# Altium schematic sheet Analog Sense.SchDoc
size A2; VersionControl_RevNumber: DNP; IsUserConfigurable: DNP; Page Size: A2; RevCode: A; PageSize: A2; TopSchematic: True; Address4: United States
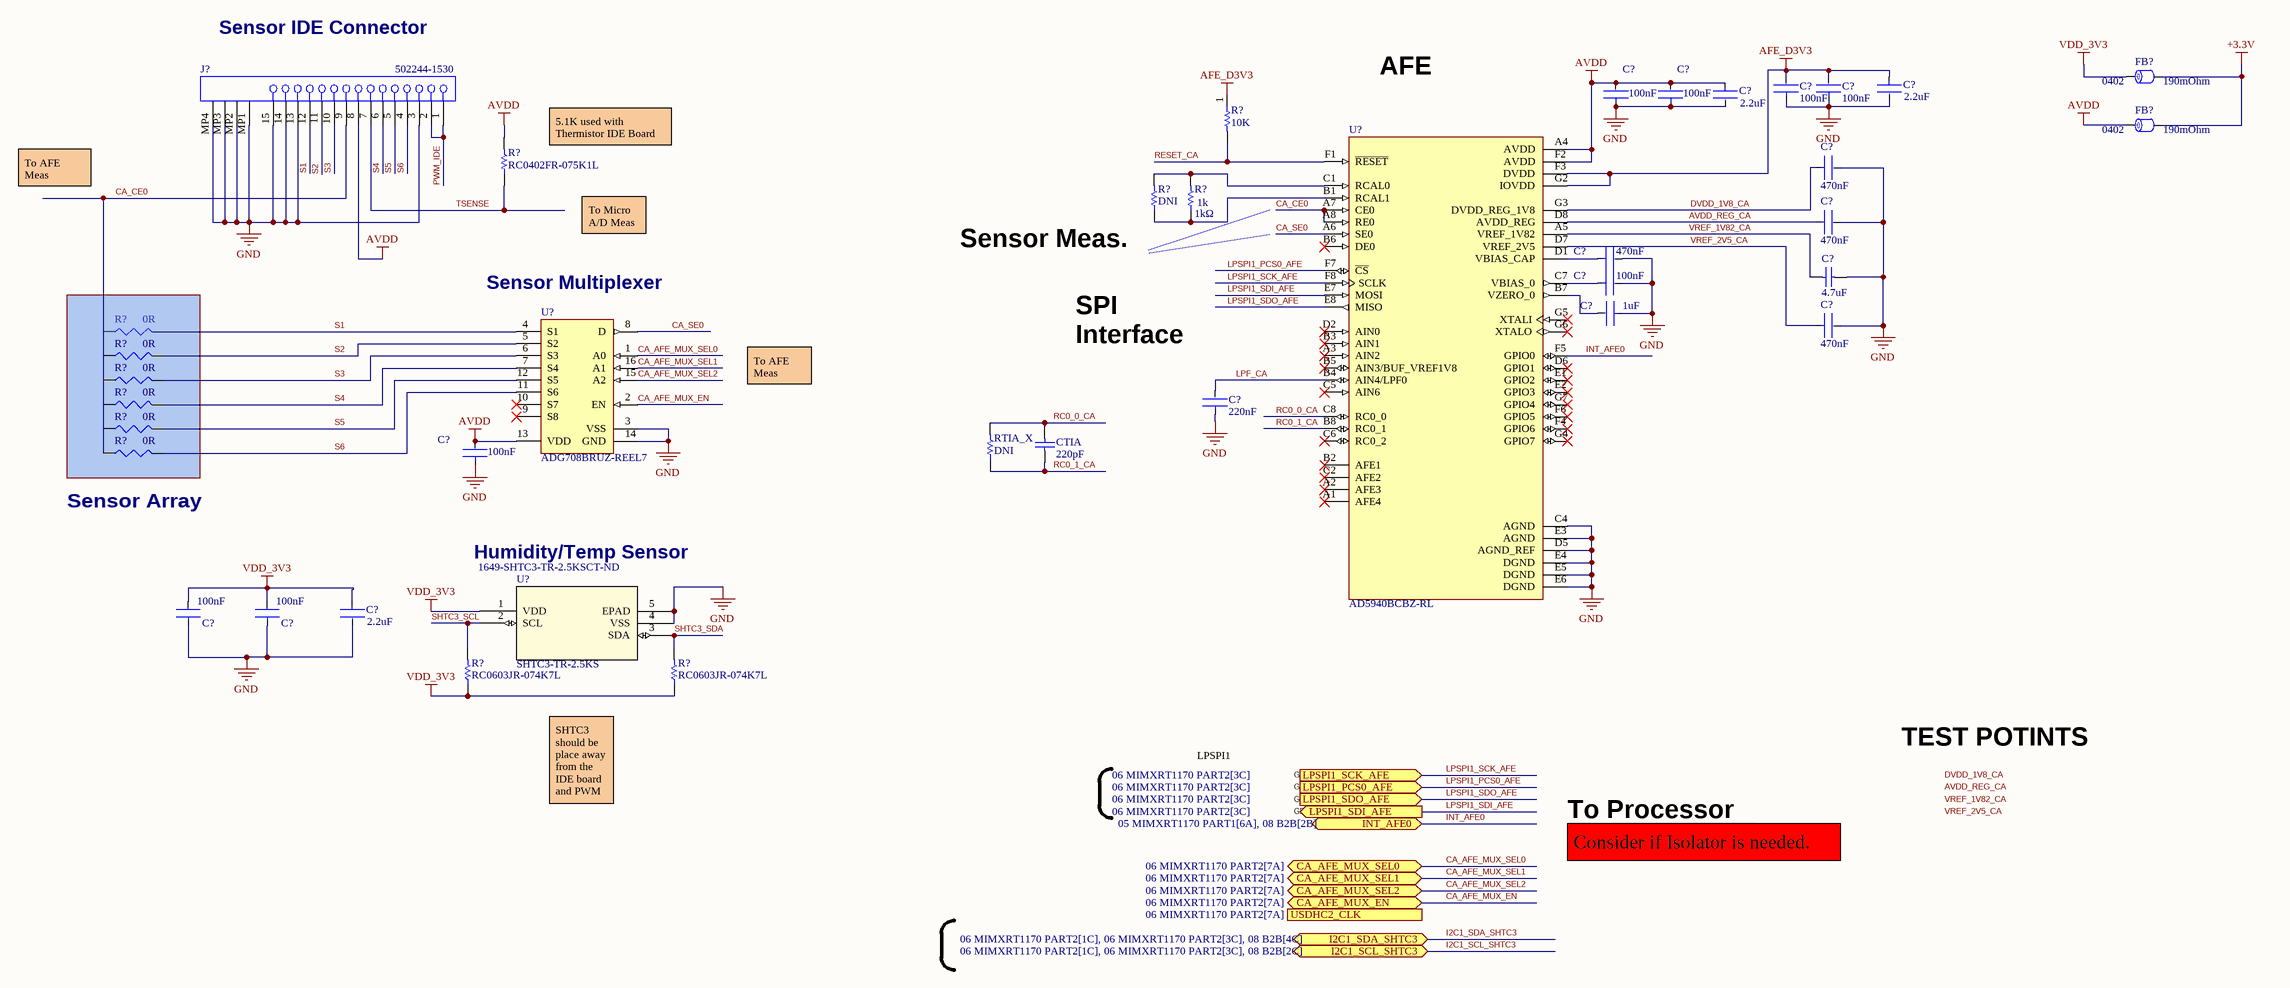
[diagram p0: Analog Sense.SchDoc]

## Parts
(Parts that share a designator on the sheet are numbered #1, #2 ... from top to bottom, then left to right.)
C?#1  Capacitance: 2.2uF  [FP-GRM155-0_2-IPC_B]  (hidden comment: GRM155R61C225KE11D)
C?#2  Capacitance: 2.2uF  [FP-GRM155-0_2-IPC_B]  (hidden comment: GRM155R61C225KE11D)
C?#3  value 100nF  [FP-C0603-CJ-MFG]  (hidden comment: C0603X104K5RACTU)
C?#4  value 100nF  [FP-C0603-CJ-MFG]  (hidden comment: C0603X104K5RACTU)
C?#5  value 100nF  [FP-C0603-CJ-MFG]  (hidden comment: C0603X104K5RACTU)
C?#6  value 100nF  [FP-C0603-CJ-MFG]  (hidden comment: C0603X104K5RACTU)
C?#7  Capacitance: 470nF  [FP-GRM188-0_1-e0_2_0_5-IPC_B]  (hidden comment: GRM188R71C474KA88D)
C?#8  Capacitance: 470nF  [FP-GRM188-0_1-e0_2_0_5-IPC_B]  (hidden comment: GRM188R71C474KA88D)
C?#9  Capacitance: 470nF  [FP-GRM188-0_1-e0_2_0_5-IPC_B]  (hidden comment: GRM188R71C474KA88D)
C?#10  4.7uF  [0603_CAP_NP]
C?#11  Capacitance: 100nF  [FP-C0603-CJ-MFG]  (hidden comment: C0603X104K5RACTU)
C?#12  Capacitance: 1uF  [FP-C1608-080-0_1-IPC_B]  (hidden comment: C1608X5R1H105K080AB)
C?#13  Capacitance: 470nF  [FP-GRM188-0_1-e0_2_0_5-IPC_B]  (hidden comment: GRM188R71C474KA88D)
C?#14  Capacitance: 220nF  [FP-GRM155-0_05-IPC_A]  (hidden comment: GRM155R61A224KE19D)
C?#15  value 100nF  [FP-C0603-CJ-MFG]  (hidden comment: C0603X104K5RACTU)
C?#16  Capacitance: 2.2uF  [FP-GRM155-0_2-IPC_B]  (hidden comment: GRM155R61C225KE11D)
C?#17  value 100nF  [FP-C0603-CJ-MFG]  (hidden comment: C0603X104K5RACTU)
C?#18  value 100nF  [FP-C0603-CJ-MFG]  (hidden comment: C0603X104K5RACTU)
CTIA  220pF  [CAPC1005X56X25LL10T15]
FB?#1  Package: 0402  Rdc max: 190mOhm  [L0402_H0.55MM]  (hidden comment: __Template_Ferrite_Bead)
FB?#2  Package: 0402  Rdc max: 190mOhm  [L0402_H0.55MM]  (hidden comment: __Template_Ferrite_Bead)
J?  502244-1530  [MOLX-502244-1530]
R?#1  Resistance: 10K  [RESC1005X40X25ML05T10]  (hidden comment: CRCW040210K0FKEDHP)
R?#2  RC0402FR-075K1L  [RESC1005X40X25NL05T10]
R?#3  value DNI  [0402_RES]  (hidden comment: 0Ω)
R?#4  1k  value 1kΩ  [0402_RES]
R?#5  0R  [R0805]  (graphical)
R?#6  0R  [R0805]  (graphical)
R?#7  0R  [R0805]  (graphical)
R?#8  0R  [R0805]  (graphical)
R?#9  0R  [R0805]  (graphical)
R?#10  0R  [R0805]  (graphical)
R?#11  RC0603JR-074K7L  [RESC1608X55X25ML10T15]
R?#12  RC0603JR-074K7L  [RESC1608X55X25ML10T15]
RTIA_X  value DNI  [0402_RES]  (hidden comment: 0Ω)
U?#1  ADG708BRUZ-REEL7  [ADI-RU-16_N]
U?#2  AD5940BCBZ-RL  [BGA56N40P7X8_356X416X55N]
U?#3  SHTC3-TR-2.5KS  Supplier Part Number 1: 1649-SHTC3-TR-2.5KSCT-ND  [SHTC3_SEN]

## Ports
CA_AFE_MUX_EN (bidir, see 06 MIMXRT1170 PART2[7A]), CA_AFE_MUX_SEL0 (bidir, see 06 MIMXRT1170 PART2[7A]), CA_AFE_MUX_SEL1 (bidir, see 06 MIMXRT1170 PART2[7A]), CA_AFE_MUX_SEL2 (bidir, see 06 MIMXRT1170 PART2[7A]), I2C1_SCL_SHTC3 (bidir, see 06 MIMXRT1170 PART2[1C], 06 MIMXRT1170 PART2[3C], 08 B2B[2C]), I2C1_SDA_SHTC3 (bidir, see 06 MIMXRT1170 PART2[1C], 06 MIMXRT1170 PART2[3C], 08 B2B[4C]), INT_AFE0 (bidir, see 05 MIMXRT1170 PART1[6A], 08 B2B[2B]), LPSPI1_PCS0_AFE (in, see 06 MIMXRT1170 PART2[3C]), LPSPI1_SCK_AFE (in, see 06 MIMXRT1170 PART2[3C]), LPSPI1_SDI_AFE (out, see 06 MIMXRT1170 PART2[3C]), LPSPI1_SDO_AFE (in, see 06 MIMXRT1170 PART2[3C]), USDHC2_CLK (in, see 06 MIMXRT1170 PART2[7A])

## Nets
+3.3V: FB?#1.2 FB?#2.2
AFE_D3V3: C?#1.1 C?#3.2 C?#4.2 R?#1.1 U?#2.F3(DVDD) U?#2.G2(IOVDD)
AVDD: C?#2.1 C?#5.2 C?#6.2 C?#15.2 FB?#2.1 J?.8 R?#2.2 U?#1.13(VDD) U?#2.A4(AVDD) U?#2.F2(AVDD)
GND: C?#1.2 C?#2.2 C?#3.1 C?#4.1 C?#5.1 C?#6.1 C?#7.2 C?#8.2 C?#9.2 C?#10.2 C?#11.2 C?#12.2 C?#13.2 C?#14.1 C?#15.1 C?#16.2 C?#17.1 C?#18.1 J?.3 J?.13 J?.14 J?.15 J?.MP1 J?.MP2 J?.MP3 J?.MP4 U?#1.3(VSS) U?#1.14(GND) U?#2.C4(AGND) U?#2.D5(AGND_REF) U?#2.E3(AGND) U?#2.E4(DGND) U?#2.E5(DGND) U?#2.E6(DGND) U?#3.4(VSS) U?#3.5(EPAD)
VDD_3V3: C?#16.1 C?#17.2 C?#18.2 FB?#1.1 R?#11.1 R?#12.1 U?#3.1(VDD)
AVDD_REG_CA: C?#8.1 U?#2.D8(AVDD_REG)
CA_AFE_MUX_EN: U?#1.2(EN) ; port CA_AFE_MUX_EN
CA_AFE_MUX_SEL0: U?#1.1(A0) ; port CA_AFE_MUX_SEL0
CA_AFE_MUX_SEL1: U?#1.16(A1) ; port CA_AFE_MUX_SEL1
CA_AFE_MUX_SEL2: U?#1.15(A2) ; port CA_AFE_MUX_SEL2
CA_CE0: J?.9 R?#5.1 R?#6.1 R?#7.1 R?#8.1 R?#9.1 R?#10.1 U?#2.A7(CE0) U?#2.A8(RE0)
CA_SE0: U?#1.8(D) U?#2.A6(SE0)
DVDD_1V8_CA: C?#7.1 U?#2.G3(DVDD_REG_1V8)
I2C1_SCL_SHTC3: port I2C1_SCL_SHTC3
I2C1_SDA_SHTC3: port I2C1_SDA_SHTC3
INT_AFE0: U?#2.F5(GPIO0) ; port INT_AFE0
LPF_CA: C?#14.2 U?#2.B4(AIN4/LPF0)
LPSPI1_PCS0_AFE: U?#2.F7(~{CS}) ; port LPSPI1_PCS0_AFE
LPSPI1_SCK_AFE: U?#2.F8(SCLK) ; port LPSPI1_SCK_AFE
LPSPI1_SDI_AFE: U?#2.E7(MOSI) ; port LPSPI1_SDI_AFE
LPSPI1_SDO_AFE: U?#2.E8(MISO) ; port LPSPI1_SDO_AFE
PWM_IDE: J?.1 J?.2
RC0_0_CA: CTIA.2 RTIA_X.2 U?#2.C8(RC0_0)
RC0_1_CA: CTIA.1 RTIA_X.1 U?#2.B8(RC0_1)
RESET_CA: R?#1.2 U?#2.F1(~{RESET})
S1: J?.12 R?#5.2 U?#1.4(S1)
S2: J?.11 R?#6.2 U?#1.5(S2)
S3: J?.10 R?#7.2 U?#1.6(S3)
S4: J?.6 R?#8.2 U?#1.7(S4)
S5: J?.5 R?#9.2 U?#1.12(S5)
S6: J?.4 R?#10.2 U?#1.11(S6)
SHTC3_SCL: R?#11.2 U?#3.2(SCL)
SHTC3_SDA: R?#12.2 U?#3.3(SDA)
TSENSE: J?.7 R?#2.1
VREF_1V82_CA: C?#10.1 U?#2.A5(VREF_1V82)
VREF_2V5_CA: C?#13.1 U?#2.D7(VREF_2V5)
NetC?#9_1: C?#9.1 U?#2.D1(VBIAS_CAP)
NetC?#11_1: C?#11.1 U?#2.C7(VBIAS_0)
NetC?#12_1: C?#12.1 U?#2.B7(VZERO_0)
NetR?#3_1: R?#3.1 R?#4.1 U?#2.B1(RCAL1)
NetR?#3_2: R?#3.2 R?#4.2 U?#2.C1(RCAL0)

Not connected (* = marked no-connect by the designer): U?#1 9(S8)* 10(S7)*; U?#2 A1(AFE4)* A2(AFE3)* A3(AIN2)* B2(AFE1)* B3(AIN1)* B5(AIN3/BUF_VREF1V8)* B6(DE0)* C2(AFE2)* C5(AIN6)* C6(RC0_2)* D2(AIN0)* D6(GPIO1)* E1(GPIO2)* E2(GPIO3)* F4(GPIO6)* F6(GPIO5)* G4(GPIO7)* G5(XTALI)* G6(XTALO)* G7(GPIO4)*

## Notes on the sheet
- Sensor IDE Connector
- AFE
- To AFE Meas
- (near R?#2) 5.1K used with Thermistor IDE Board
- (near R?#3) CALIBRATION
- To Micro A/D Meas
- (near U?#1) Sensor Multiplexer
- (near R?#3) Sensor Meas. Inputs
- To AFE  Meas
- TIA FILTER
- (near C?#14) SPI Interface
- (near R?#10) Sensor Array
- (near U?#3) Humidity/Temp Sensor
- SHTC3 should be place away from the IDE board and PWM FET to pick up closer to ambient temperature
- LPSPI1
- GPIO_AD_28
- GPIO_AD_29
- TEST POTINTS
- GPIO_AD_30
- GPIO_AD_31
- To Processor
- Consider if Isolator is needed.
- Labels drawn without touching a wire or pin: AVDD_REG_CA, DVDD_1V8_CA, VREF_1V82_CA, VREF_2V5_CA
- Title
- Size:
- Date:
- File:
- A2
- Number:
- Time:
- Revision:
- Sheet
- of

## Library data of the parts
C?#1 C?#2 C?#16 = CMP-06035-001793-1: Chip Multilayer Ceramic Capacitors for General Purpose, 0402, 2.2uF, X5R, 15%, 10%, 16V; Tolerance: 10%; Packaging: Tape and Reel; Lead Free: Lead Free; Mount: Surface Mount; Width: 0.02inch; Case/Package: 0402; Case Code (Metric): 1005; Thickness: 0.022inch; Max Operating Temperature: 85°C; Min Operating Temperature: -55°C; Voltage Rating: 16V; Voltage Rating (DC): 16V; Material: Ceramic; Height: 0.3mm; Case Code (Imperial): 0402; Length: 0.039inch
C?#3-C?#6 C?#15 C?#17 C?#18 = CMP-2006-03300-2: CAP CER 0.1UF 50V X7R 0603; Manufacturer: Kemet; Material: Ceramic; Tolerance: 10%; Temperature Coefficient: 15%; Temperature Range High: +125°C; Temperature Range Low: -55°C; Manufacturer Part Number: C0603X104K5RACTU; Voltage: 50V; ComponentLink2Description: Datasheet; RoHS: TRUE; ComponentLink2URL: https://content.kemet.com/datasheets/KEM_C1013_X7R_FT-CAP_SMD.pdf; Capacitance: 100nF; Device Class L3: Ceramic Capacitors; Device Class L2: Capacitors; Package: C0603-CJ; Height: 0.95mm; Device Class L1: Passive Components; Temperature Characteristic: X7R; Lead Free: Yes; Digikey Description: CAP CER 0.1UF 50V X7R 0603; Automotive: No; Mouser Description: Capacitor; Ceramic; Cap 0.1uF; Tol+10%; SMT; Flexible Termination; Vol-Rtg 50V; TR; Temperature: -55°C to +125°C; Octopart: https://octopart.com/c0603x104k5ractu-kemet-9145062; Category: Cap; Voltage Rating: 50V; Ipc Land Pattern Name: CAPC16080X80
C?#7-C?#9 C?#13 = CMP-2006-02860-2: Chip Multilayer Ceramic Capacitors for General Purpose, 0603, 0.47uF, X7R, 15%, 10%, 16V; Material: Ceramic; Termination: SMD/SMT; Case Code (Imperial): 0603; Height: 0.8mm; Dielectric: X7R; Length: 1.6mm; Packaging: Tape and Reel; Mount: Surface Mount; Thickness: 0.035inch; Voltage Rating (DC): 16V; Case Code (Metric): 1608; REACH SVHC: No SVHC; Depth: 0.8mm; Number of Pins: 2; Max Operating Temperature: 125°C; Min Operating Temperature: -55°C; Width: 0.8mm; Voltage: 16V; Lead Free: Lead Free; Voltage Rating: 16V; Package Quantity: 1; Case/Package: 0603; Tolerance: 10%
C?#10 = 0603C_4.7uF_6.3V_10%_X7R: Ceramic Cap 4.7µF ±10% 6.3V X7R 0603; MPN: CL10B475KQ8NQNC; Mfg: Samsung; Unit Cost, Qty 1: $0.10; Unit Cost, Qty 500: $0.023; Value: 4.7uF
C?#11 = CMP-2006-03300-2: CAP CER 0.1UF 50V X7R 0603; Manufacturer: Kemet; Material: Ceramic; Tolerance: 10%; Value: 100nF; Temperature Coefficient: 15%; Temperature Range High: +125°C; Temperature Range Low: -55°C; Manufacturer Part Number: C0603X104K5RACTU; Voltage: 50V; ComponentLink2Description: Datasheet; RoHS: TRUE; ComponentLink2URL: https://content.kemet.com/datasheets/KEM_C1013_X7R_FT-CAP_SMD.pdf; Device Class L3: Ceramic Capacitors; Device Class L2: Capacitors; Package: C0603-CJ; Height: 0.95mm; Device Class L1: Passive Components; Temperature Characteristic: X7R; Lead Free: Yes; Digikey Description: CAP CER 0.1UF 50V X7R 0603; Automotive: No; Mouser Description: Capacitor; Ceramic; Cap 0.1uF; Tol+10%; SMT; Flexible Termination; Vol-Rtg 50V; TR; Temperature: -55°C to +125°C; Octopart: https://octopart.com/c0603x104k5ractu-kemet-9145062; Category: Cap; Voltage Rating: 50V; Ipc Land Pattern Name: CAPC16080X80
C?#12 = CMP-2000-06025-2: Multilayer Ceramic Capacitors 1μF ±10% 50V X5R SMD 0603; Series: C; Tolerance: 10%; Packaging: Tape and Reel; Lead Free: Lead Free; Height: 0.8mm; Mount: Surface Mount; Radiation Hardening: No; Thickness: 0.035inch; Length: 1.6mm; Max Operating Temperature: 85°C; REACH SVHC: No SVHC; Min Operating Temperature: -55°C; Construction: Flat; RoHS Compliant: Yes; Voltage Rating: 50V; Dielectric: X5R; Termination: SMD/SMT; Voltage Rating (DC): 50V; Case Code (Imperial): 0603; Voltage: 50V; Width: 0.031inch; Weight: 7.1E-05oz; Depth: 0.8mm; Case Code (Metric): 1608; Case/Package: 0603; Resistor Type: Ceramic; Number of Pins: 2; Dielectric Material: Ceramic; Package Quantity: 1
C?#14 = CMP-2008-04561-5: CAP CER 0.22UF 10V X5R 0402; Tolerance: 10%; Material: Ceramic; Insulation Resistance: 10GR; Max Operating Temperature: 85°C; Package Quantity: 1; Height: 0.5mm; Case Code (Metric): 1005; Case Code (Imperial): 0402; Length: 1mm; Voltage Rating: 10V; Radiation Hardening: No; Voltage Rating (DC): 10V; Width: 0.5mm; REACH SVHC: No SVHC; Min Operating Temperature: -55°C; Mount: Surface Mount; Packaging: Tape and Reel; Termination: SMD/SMT; Voltage: 10V; Thickness: 0.022inch; Lead Free: Lead Free; Number of Pins: 2; Case/Package: 0402; Dielectric: X5R; Depth: 0.5mm; Series: GRM; RoHS Compliant: Yes; Dielectric Material: Ceramic
CTIA = CMP-2008-02709-1: CAP CER 220PF 50V X7R 0402 04025C221JAT2A; Manufacturer: AVX Interconnect / Elco; Part Number: 04025C221JAT2A
FB?#1 FB?#2 = 913: FERRITE, BEAD, 120 OHMS@100MHZ, 25%, 550mA, 190 mOHM DCR, 0402; ID: 913; Catagory: Ferrite Bead; MFG: Murata Electronics; MFG P/N: BLM15AG121SN1D; ComponentLink1Description: Datasheet; Status: Released; Idc max: 550mA; Supplier 1: Digi-Key; HelpURL: https://www.digikey.com/product-detail/en/murata-electronics/BLM15AG121SN1D/490-1005-1-ND/584453; ComponentLink1URL: https://www.murata.com/en-us/products/productdata/8796740059166/ENFA0018.pdf; Height: 0.55mm; Supplier Part Number 1: 490-1005-1-ND
J? = CMP-1243-00004-1: 0.5 mm Pitch Easy-On(TM) Type FFC Connector, for LVDS, 2.33 mm Mated Height, Right Angle, ZIF, SMT, Bottom Contact, 15 Circuits, -25 to 85 degC, ELV and RoHS Compliant, Tape and Reel; Manufacturer: Molex; Pitch - Mating Interface: 0.50mm; Circuits (Loaded): 15; Material - Plating Termination: Gold; PCB Locator: No; Voltage (Max): 50V AC (RMS)/DC; Current (Max per Contact): 0.4A; Mated Height: 2.33mm; Material - Metal: Phosphor Bronze; PCB Retention: Yes; Durability (mating cycles max): 20; Entry Angle: 90degrees Angle; Mounting Technology: Surface Mount; ComponentLink1URL: http://www.molex.com/molex/index.jsp; PackageDescription: 15-Lead FFC Connector, Pitch 0.5 mm; PartNumber: 502244-1530; PackageReference: 502244-1530; Orientation: Right Angle; Number of Rows: 1; Material - Plating Mating: Gold; Contact Position: Bottom; Packing: Tape and Reel; Polarized to PCB: Yes; RoHS: TRUE; ComponentLink2URL: http://www.molex.com/webdocs/datasheets/pdf/en-us/5022441530_FFC_FPC_CONNECTORS.pdf; PackageVersion: Rev. C, 03/2010; Stackable: No; ComponentLink1Description: Manufacturer URL; ComponentLink2Description: Datasheet; ComponentLink3Description: Package Specification; ComponentLink3URL: http://www.molex.com/pdm_docs/sd/5022441530_sd.pdf
R?#1 = CMP-2002-03043-1: Thick Film Resistors - SMD 0.2W 10Kohms 1% High Power AEC-Q200; Manufacturer: Vishay Dale; Part Number: CRCW040210K0FKEDHP
R?#2 = CMP-2002-07753-1: 5.1 kOhms ±1% 0.063W, 1/16W Chip Resistor 0402 (1005 Metric) Moisture Resistant Thick Film; Manufacturer: Yageo / Phycomp; Part Number: RC0402FR-075K1L
R?#3 RTIA_X = 0402R_0_0.063W: DNI 0402; Unit Cost, Qty 1: $0.10; Unit Cost, Qty 500: $0.00234; Mfg: DNI; MPN: DNI
R?#4 = 0402R_1k_1%_0.063W: RES SMD 1K OHM 1% 1/16W 0402; MPN: RC0402JR-071KL; Mfg: Yageo; Unit Cost, Qty 1: $0.10; Unit Cost, Qty 500: $0,00298
R?#5-R?#10 = RC0805FR-070RL: RES SMD 0 Ohm Thick Film 0805; Manufacturer: Yageo; Resistance: 0mR; Tolerance: 1%; Power Rating: 125mW; Supplier 1: Digi-Key; Manufacturer Part Number: RC0805FR-070RL; RoHS: Yes; Category: Chip SMD Resistors; Stock 1: 1094; Pricing 1: 1=0.10000, 10=0.03200, 25=0.02360, 50=0.01780, 100=0.01320, 250=0.01004, 500=0.00802, 1000=0.00591 (USD); Case/Package: 0805; Contact Plating: Tin,Matte; Case Code (Imperial): 0805; Case Code (Metric): 2012; Size Code: 0805; Min Operating Temperature: -55°C; Max Operating Temperature: 155°C; Resistor Type: Thick Film; Packaging: Tape and Reel; Features: Moisture Resistant; Series: RC; Max Power Dissipation: 125mW; Number of Terminations: 2; Construction: Rectangular; Length: 2mm; Depth: 1.25mm; Radiation Hardening: No; Military Standard: Not; Lead Free: Lead Free; RoHS Compliant: Yes; ComponentLink1URL: https://datasheet.ciiva.com/15189/getdatasheetpartid-348154-15189885.pdf?src-supplier=Verical; ComponentLink1Description: https://datasheet.ciiva.com/15189/getdatasheetpartid-348154-15189885.pdf?src-supplier=Verical; ComponentLink2URL: https://datasheet.ciiva.com/17042/rc0805-17042698.pdf?src-supplier=Future+Electronics; ComponentLink2Description: https://datasheet.ciiva.com/17042/rc0805-17042698.pdf?src-supplier=Future+Electronics; Supplier Part Number 1: 311-0.0CRCT-ND
R?#11 R?#12 = CMP-2000-05024-1: Chip Resistor, 4.7 KOhm, +/- 5%, 100 mW, -55 to 155 degC, 0603 (1608 Metric), RoHS, Tape and Reel; Manufacturer: Yageo; Resistance: 4.7kOhms; Temperature Coefficient: 100PPM/C; Power Rating: 100mW; Voltage Rating: 50V; Operating Temperature Range: -55Cto+155C; Case Code - mm: 1608; Tolerance: 5%; Product: ThickFilmResistorsGeneralPurpose; Case Code - in: 0603; Datasheet URL: http://www.yageo.com/documents/recent/PYu-RC_Group_51_RoHS_L_04.pdf; Package Reference: 603; Datasheet Version: Rev. 4, 02/2016; Package Description: 2-Pin Surface Mount Device, Body 1.6 x 0.8 mm; Manufacturer URL: http://www.yageo.com/; Series: RC; Packaging: Reel; Termination Style: SMD/SMT
U?#1 = CMP-0798-00194-1: 1.8 to 5.5 V / +/-2.5 V, CMOS Low Voltage 3 Ohm, 8-Channel Multiplexer, -40 to 125 degC, 16-pin SOP (RU-16), Reel; Manufacturer: Analog Devices; Ron (ohms): 3; t transition (s): 14n; Max Analog Signal Range: Vss to Vdd; Bandwidth (Hz): 55M; Supply V Guar Performance: Dual_(+/-2.5V), Single_(+3V), Single_(+5V); PartNumber: ADG708BRUZ-REEL7; PackageReference: RU-16; PackageDescription: 16-Pin Thin Shrink Small Outline Package, Body 5 x 4.4 mm, Pitch 0.65 mm; Code_JEDEC: MO-153AB; ComponentLink1Description: Manufacturer URL; PackageVersion: Nov-02; ComponentLink1URL: http://www.analog.com/en/index.html; ComponentLink2Description: Datasheet; Mounting Technology: Surface Mount; ComponentLink3URL: http:/www.analog.com/static/imported-files/packages/36244347913743854010197452789RU16.pdf; ComponentLink3Description: Package Specification; DatasheetVersion: Rev. C; Packing: Reel; ComponentLink2URL: http://www.analog.com/static/imported-files/data_sheets/ADG708_709.pdf
U?#2 = AD5940BCBZ-RL: AFE Electrochemical Measurement 1 ADC 16bit 3.3V 56-Pin WLCSP T/R; Manufacturer: Analog Devices; Interface: Analog; Operating Supply Current: 300uA; Supplier 1: Digikey; Supplier Part Number 1: 505-AD5940BCBZ-RLCT-ND; Manufacturer Part Number: AD5940BCBZ-RL; RoHS: Yes; Category: Analog to Digital Converters (ADCs); Stock: 4230; Pricing: 1=13.27, 10=9.176, 25=8.108, 100=6.9004, 250=6.68752 (USD); Pins: 56; Output Type: Analog; RoHS Compliant: Yes
U?#3 = SHTC3-TR-2.5KS: Humidity Temperature Sensor 0 ~ 100% RH I²C ±2% RH 8 s Surface Mount; Mfr_Name: Sensirion; Copyright: Copyright (C) 2022 Ultra Librarian. All rights reserved.; Manufacturer_Part_Number: SHTC3-TR-2.5KS; Digi-Key_Part_Number_1: 1649-SHTC3-TR-10kSCT-ND; Digi-Key_Part_Number_2: 1649-SHTC3-TR-10kSDKR-ND; Digi-Key_Part_Number_3: 1649-SHTC3-TR-10kSTR-ND; Digi-Key_Part_Number_4: 1649-SHTC3-TR-2.5KSCT-ND; Digi-Key_Part_Number_5: 1649-SHTC3-TR-2.5KSDKR-ND; Digi-Key_Part_Number_6: 1649-SHTC3-TR-2.5KSTR-ND; RefDes: RefDes; Type: DEV; Supplier 1: Digi-Key